# Altium schematic sheet ZhenDong.SchDoc
size A2
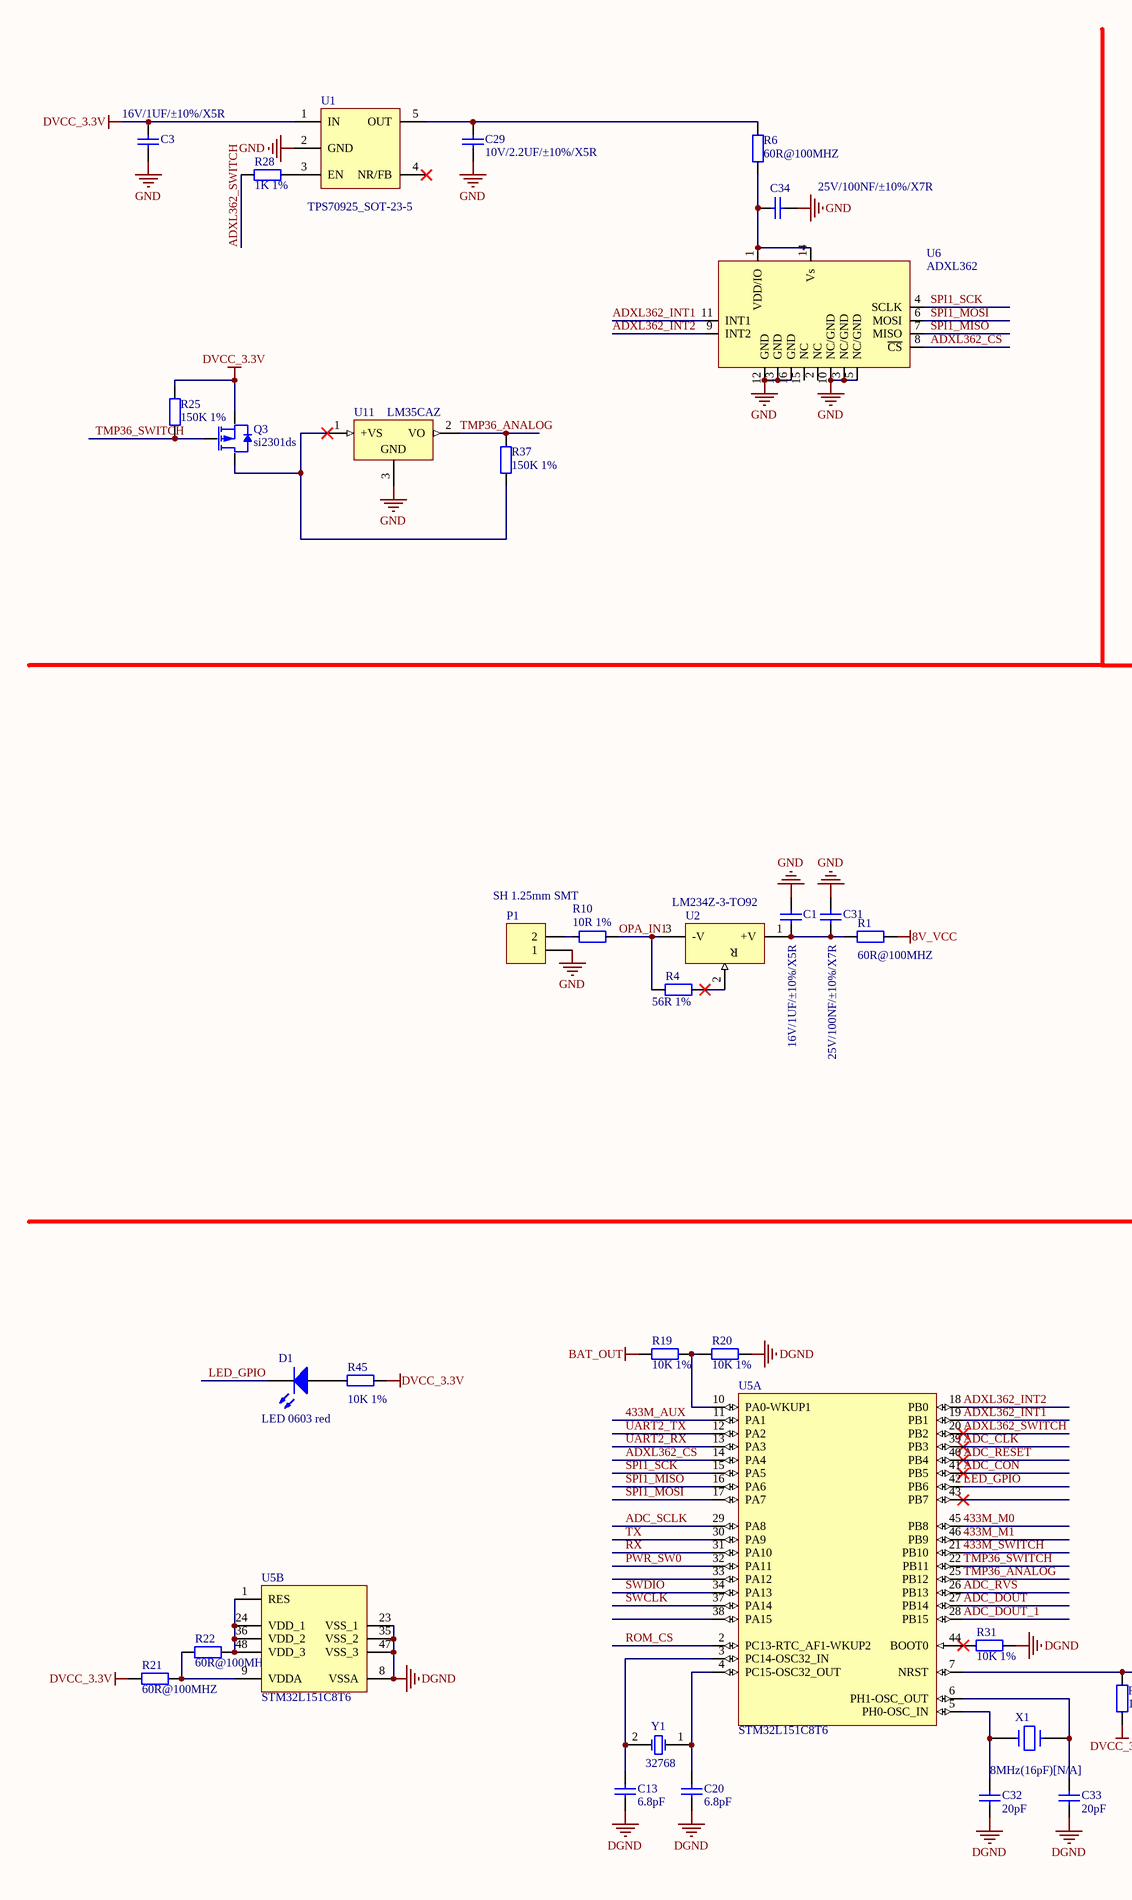
[diagram p0: ZhenDong.SchDoc, left]
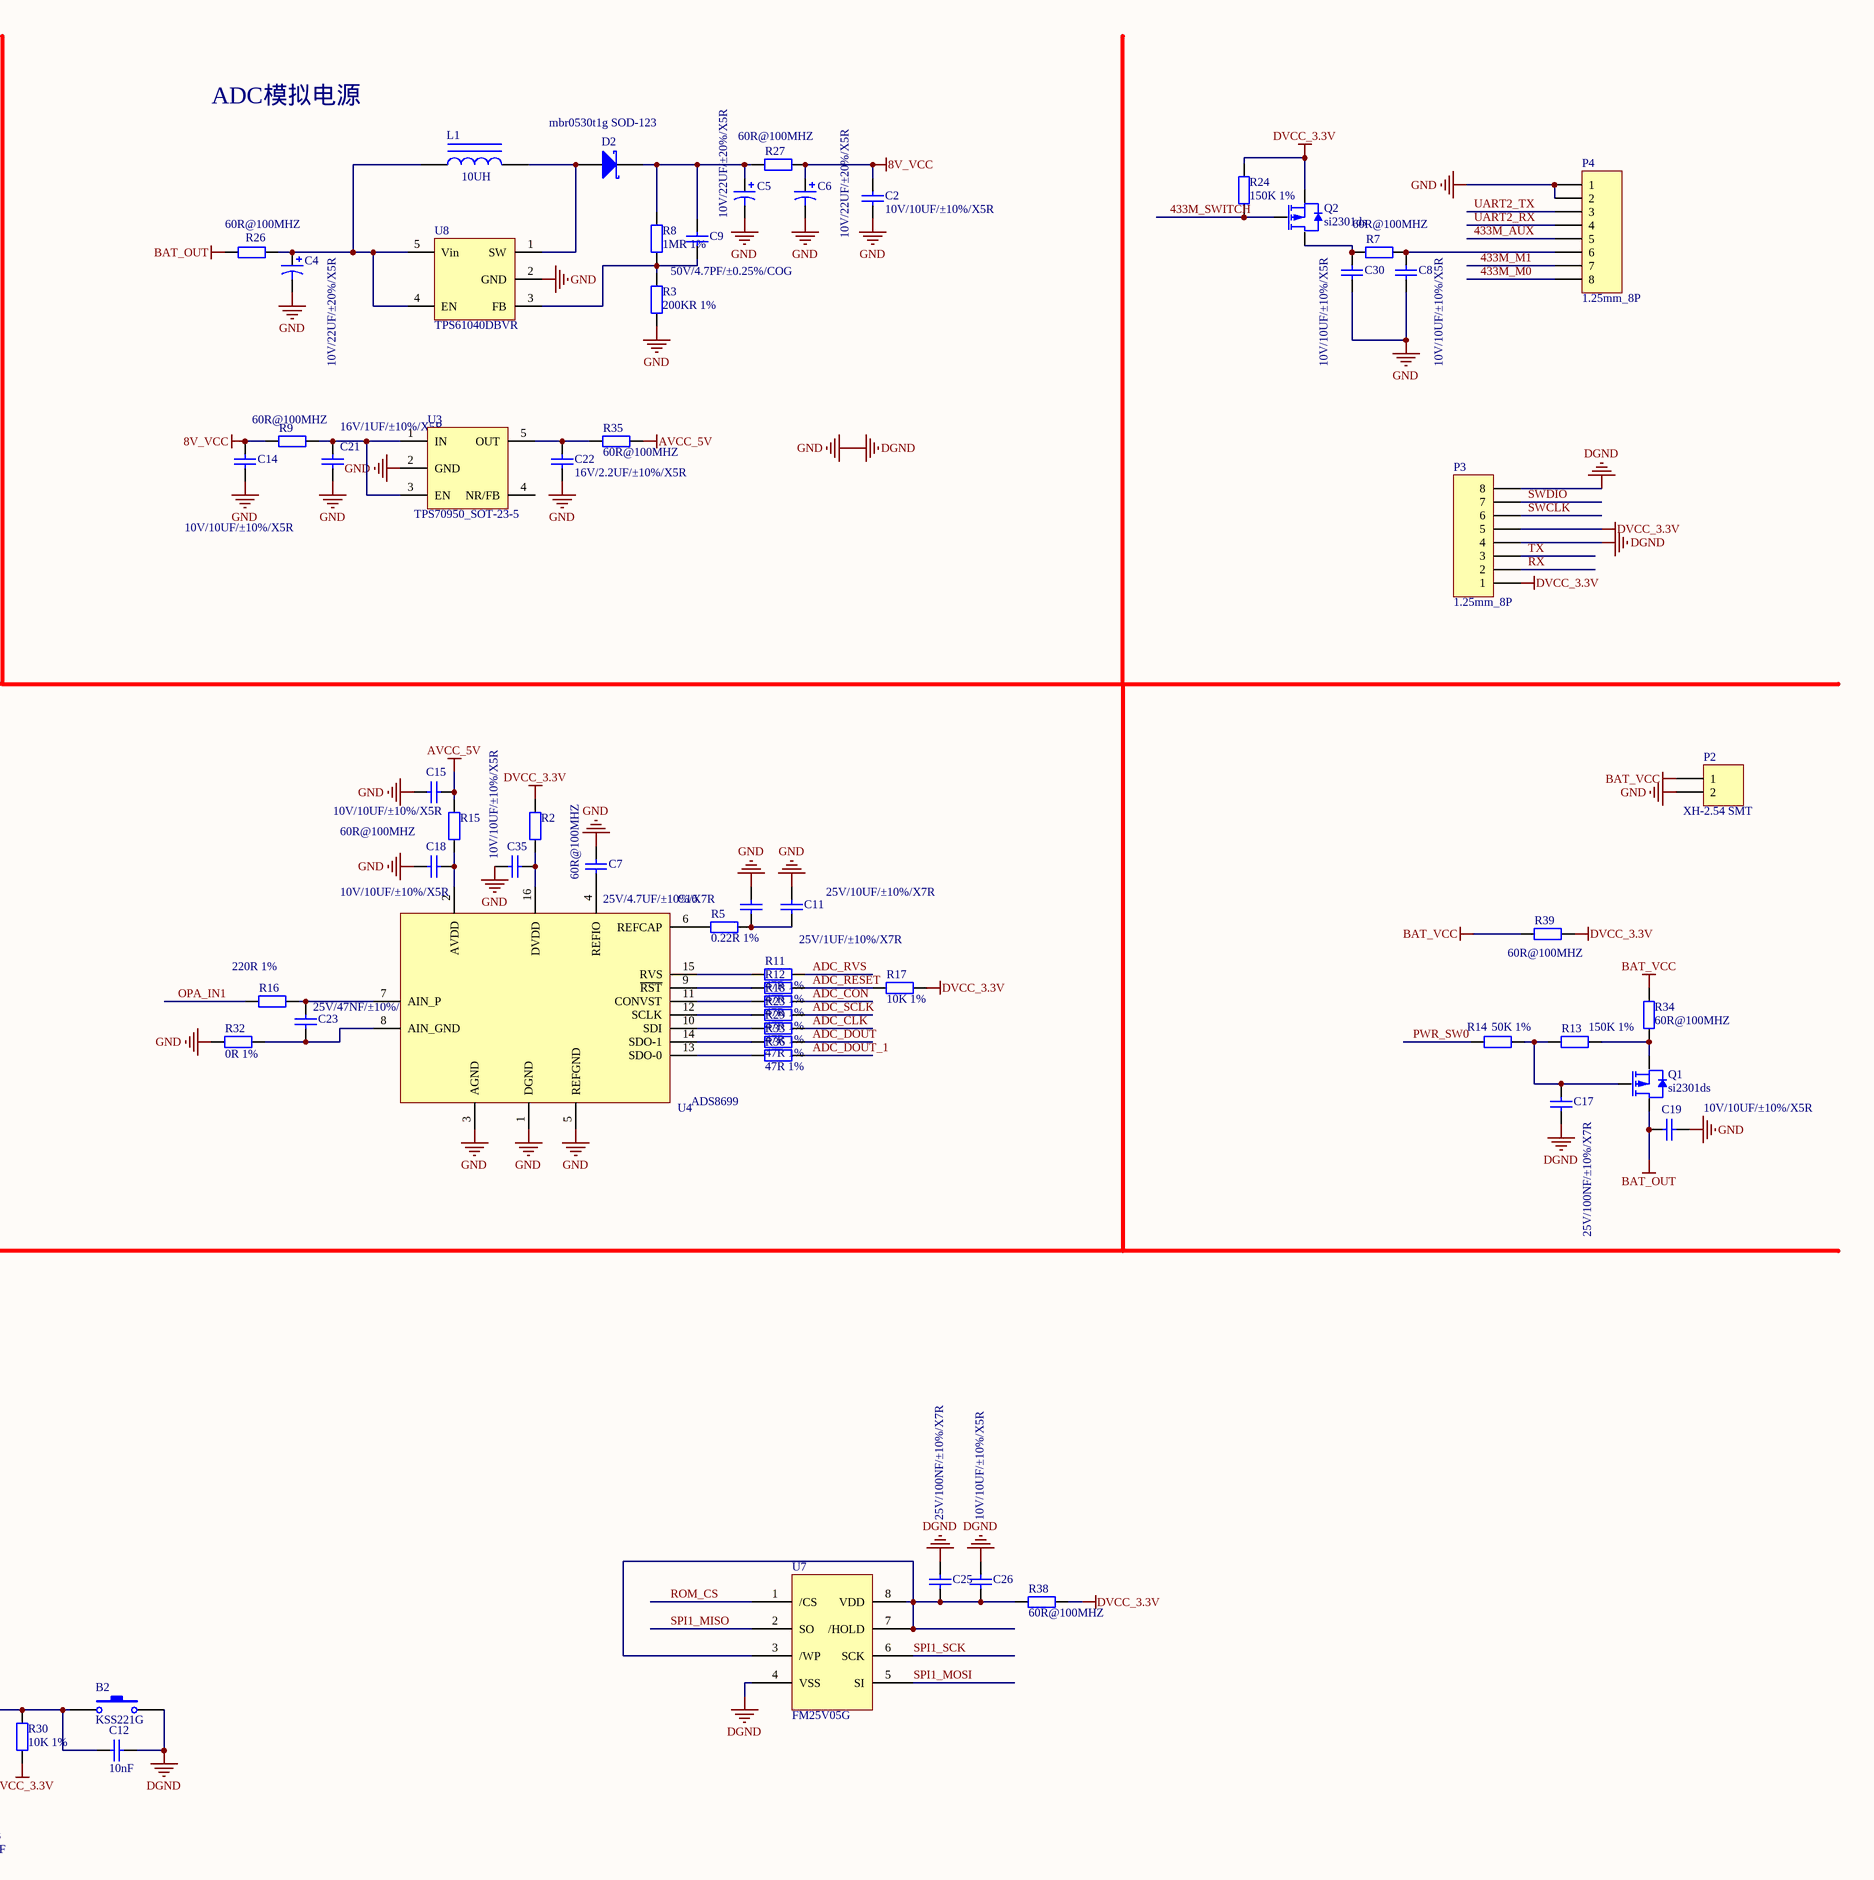
[diagram p1: ZhenDong.SchDoc, right]

## Parts
B2  KSS221G  [MY-KEY1]
C1  value 16V/1UF/±10%/X5R  [0603C]  (hidden comment: Capacitor 0603)
C2  value 10V/10UF/±10%/X5R  [0603C]  (hidden comment: Capacitor 0603)
C3  value 16V/1UF/±10%/X5R  [0603C]  (hidden comment: Capacitor 0603)
C4  value 10V/22UF/±20%/X5R  [0805C]  (hidden comment: Capacitor 0805)
C5  value 10V/22UF/±20%/X5R  [0805C]  (hidden comment: Capacitor 0805)
C6  value 10V/22UF/±20%/X5R  [0805C]  (hidden comment: Capacitor 0805)
C7  value 25V/4.7UF/±10%/X7R  [0603C]  (hidden comment: Capacitor 0603)
C8  value 10V/10UF/±10%/X5R  [0603C]  (hidden comment: Capacitor 0603)
C9  value 50V/4.7PF/±0.25%/COG  [0603C]  (hidden comment: Capacitor 0603)
C11  value 25V/1UF/±10%/X7R  [0603C]  (hidden comment: Capacitor 0603)
C12  10nF  [0603C]
C13  6.8pF  [0603C]
C14  value 10V/10UF/±10%/X5R  [0603C]  (hidden comment: Capacitor 0603)
C15  value 10V/10UF/±10%/X5R  [0603C]  (hidden comment: Capacitor 0603)
C16  value 25V/10UF/±10%/X7R  [0603C]  (hidden comment: Capacitor 0603)
C17  value 25V/100NF/±10%/X7R  [0603C]  (hidden comment: Capacitor 0603)
C18  value 10V/10UF/±10%/X5R  [0603C]  (hidden comment: Capacitor 0603)
C19  value 10V/10UF/±10%/X5R  [0603C]  (hidden comment: Capacitor 0603)
C20  6.8pF  [0603C]
C21  value 16V/1UF/±10%/X5R  [0603C]  (hidden comment: Capacitor 0603)
C22  value 16V/2.2UF/±10%/X5R  [0603C]  (hidden comment: Capacitor 0603)
C23  value 25V/47NF/±10%/X7R  [0603C]  (hidden comment: Capacitor 0603)
C25  value 25V/100NF/±10%/X7R  [0603C]  (hidden comment: Capacitor 0603)
C26  value 10V/10UF/±10%/X5R  [0603C]  (hidden comment: Capacitor 0603)
C29  value 10V/2.2UF/±10%/X5R  [0603C]  (hidden comment: Capacitor 0603)
C30  value 10V/10UF/±10%/X5R  [0603C]  (hidden comment: Capacitor 0603)
C31  value 25V/100NF/±10%/X7R  [0603C]  (hidden comment: Capacitor 0603)
C32  20pF  [0603C]
C33  20pF  [0603C]
C34  value 25V/100NF/±10%/X7R  [0603C]  (hidden comment: Capacitor 0603)
C35  value 10V/10UF/±10%/X5R  [0603C]  (hidden comment: Capacitor 0603)
D1  LED 0603 red  [0603R]
D2  mbr0530t1g SOD-123  [0805D]
L1  value 10UH  [0420]  (hidden comment: Inductance 0420)
P1  SH 1.25mm SMT  [1.25-2p]
P2  XH-2.54 SMT  [2.54_W_2P]
P3  1.25mm_8P  [1.25-8P]
P4  1.25mm_8P  [1.25-8P]
Q1  si2301ds  [SOT-23]
Q2  si2301ds  [SOT-23]
Q3  si2301ds  [SOT-23]
R1  value 60R@100MHZ  [0603R]  (hidden comment: Ferrite Bead 0603)
R2  value 60R@100MHZ  [0603R]  (hidden comment: Ferrite Bead 0603)
R3  value 200KR 1%  [0603R]  (hidden comment: Resistor 0603)
R4  value 56R 1%  [0603R]  (hidden comment: Resistor 0603)
R5  value 0.22R 1%  [0603R]  (hidden comment: Resistor 0603)
R6  value 60R@100MHZ  [0603R]  (hidden comment: Ferrite Bead 0603)
R7  value 60R@100MHZ  [0603R]  (hidden comment: Ferrite Bead 0603)
R8  value 1MR 1%  [0603R]  (hidden comment: Resistor 0603)
R9  value 60R@100MHZ  [0603R]  (hidden comment: Ferrite Bead 0603)
R10  value 10R 1%  [0603R]  (hidden comment: Resistor 0603)
R11  value 47R 1%  [0603R]  (hidden comment: Resistor 0603)
R12  value 47R 1%  [0603R]  (hidden comment: Resistor 0603)
R13  value 150K 1%  [0603R]  (hidden comment: Resistor 0603)
R14  value 50K 1%  [0603R]  (hidden comment: Resistor 0603)
R15  value 60R@100MHZ  [0603R]  (hidden comment: Ferrite Bead 0603)
R16  value 220R 1%  [0603R]  (hidden comment: Resistor 0603)
R17  value 10K 1%  [0603R]  (hidden comment: Resistor 0603)
R18  value 47R 1%  [0603R]  (hidden comment: Resistor 0603)
R19  value 10K 1%  [0603R]  (hidden comment: Resistor 0603)
R20  value 10K 1%  [0603R]  (hidden comment: Resistor 0603)
R21  value 60R@100MHZ  [0603R]  (hidden comment: Ferrite Bead 0603)
R22  value 60R@100MHZ  [0603R]  (hidden comment: Ferrite Bead 0603)
R23  value 47R 1%  [0603R]  (hidden comment: Resistor 0603)
R24  value 150K 1%  [0603R]  (hidden comment: Resistor 0603)
R25  value 150K 1%  [0603R]  (hidden comment: Resistor 0603)
R26  value 60R@100MHZ  [0603R]  (hidden comment: Ferrite Bead 0603)
R27  value 60R@100MHZ  [0603R]  (hidden comment: Ferrite Bead 0603)
R28  value 1K 1%  [0603R]  (hidden comment: Resistor 0603)
R29  value 47R 1%  [0603R]  (hidden comment: Resistor 0603)
R30  value 10K 1%  [0603R]  (hidden comment: Resistor 0603)
R31  value 10K 1%  [0603R]  (hidden comment: Resistor 0603)
R32  value 0R 1%  [0603R]  (hidden comment: Resistor 0603)
R33  value 47R 1%  [0603R]  (hidden comment: Resistor 0603)
R34  value 60R@100MHZ  [0603R]  (hidden comment: Ferrite Bead 0603)
R35  value 60R@100MHZ  [0603R]  (hidden comment: Ferrite Bead 0603)
R36  value 47R 1%  [0603R]  (hidden comment: Resistor 0603)
R37  value 150K 1%  [0603R]  (hidden comment: Resistor 0603)
R38  value 60R@100MHZ  [0603R]  (hidden comment: Ferrite Bead 0603)
R39  value 60R@100MHZ  [0603R]  (hidden comment: Ferrite Bead 0603)
R45  value 10K 1%  [0603R]  (hidden comment: Resistor 0603)
U1  TPS70925_SOT-23-5  [SOT23-5]
U2  LM234Z-3-TO92  [Z03A]
U3  TPS70950_SOT-23-5  [SOT23-5]
U4  ADS8699  [TSSOP16]
U5  STM32L151C8T6  [LQFP48_L]  (parts A,B of 2)
U6  ADXL362  [LGA_CC-16-4]
U7  FM25V05G  [SOP8-long]
U8  TPS61040DBVR  [SOT23-5]
U11  LM35CAZ  [Z03A]
X1  8MHz(16pF)[N/A]  [NLFC3225]
Y1  32768  [CRYSTAL_3215]

## Nets
8V_VCC: C2.2 C6.1 C14.1 R1.2 R9.2 R27.1
AVCC_5V: C15.2 R15.1 R35.1
BAT_OUT: C19.2 Q1.3(D) R19.2 R26.2
BAT_VCC: P2.1 R34.2 R39.1
DGND: B2.2 C1.2 C2.1 C3.2 C4.2 C5.2 C6.2 C7.2 C8.1 C11.2 C12.1 C13.2 C14.2 C15.1 C16.1 C17.2 C18.1 C19.1 C20.2 C21.2 C22.2 C25.1 C26.1 C29.2 C30.2 C31.1 C32.2 C33.2 C34.2 C35.2 P1.1 P2.2 P3.4 P3.8 P4.1 P4.2 R3.2 R20.1 R31.2 R32.1 U1.2(GND) U3.2(GND) U4.1(DGND) U4.3(AGND) U4.5(REFGND) U5.8(VSSA) U5.23(VSS_1) U5.35(VSS_2) U5.47(VSS_3) U6.3(NC/GND) U6.5(NC/GND) U6.10(NC/GND) U6.12(GND) U6.13(GND) U6.16(GND) U7.4(VSS) U8.2(GND) U11.3(GND)  [also labelled GND]
DVCC_3.3V: C3.1 P3.1 P3.5 Q2.2(S) Q3.2(S) R2.1 R17.1 R21.2 R24.2 R25.2 R30.2 R38.2 R39.2 R45.1 U1.1(IN)
433M_AUX: P4.5 U5.11(PA1)
433M_M0: P4.8 U5.45(PB8)
433M_M1: P4.7 U5.46(PB9)
433M_SWITCH: Q2.1(G) R24.1 U5.21(PB10)
ADC_CLK: R29.1 U5.39(PB3)
ADC_CON: R18.1 U5.41(PB5)
ADC_DOUT: R33.1 U5.27(PB14)
ADC_DOUT_1: R36.1 U5.28(PB15)
ADC_RESET: R12.1 R17.2 U5.40(PB4)
ADC_RVS: R11.1 U5.26(PB13)
ADC_SCLK: R23.1 U5.29(PA8)
ADXL362_~{CS}: U5.14(PA4) U6.8(~{CS})
ADXL362_INT1: U5.19(PB1) U6.11(INT1)
ADXL362_INT2: U5.18(PB0) U6.9(INT2)
ADXL362_SWITCH: R28.2 U5.20(PB2)
LED_GPIO: D1.2(K) U5.42(PB6)
OPA_IN1: R4.1 R10.1 R16.1 U2.3(-V)
PWR_SW0: R14.2 U5.32(PA11)
ROM_CS: U5.2(PC13-RTC_AF1-WKUP2) U7.1(/CS)
RX: P3.2 U5.31(PA10)
SPI1_MISO: U5.16(PA6) U6.7(MISO) U7.2(SO)
SPI1_MOSI: U5.17(PA7) U6.6(MOSI) U7.5(SI)
SPI1_SCK: U5.15(PA5) U6.4(SCLK) U7.6(SCK)
SWCLK: P3.6 U5.37(PA14)
SWDIO: P3.7 U5.34(PA13)
TMP36_ANALOG: R37.2 U5.25(PB12) U11.2(VO)
TMP36_SWITCH: Q3.1(G) R25.1 U5.22(PB11)
TX: P3.3 U5.30(PA9)
UART2_RX: P4.4 U5.13(PA3)
UART2_TX: P4.3 U5.12(PA2)
NetB2_1: B2.1 C12.2 R30.1 U5.7(NRST)
NetC1_1: C1.1 C31.2 R1.1 U2.1(+V)
NetC4_1: C4.1 L1.1 R26.1 U8.4(EN) U8.5(Vin)
NetC5_1: C5.1 C9.1 D2.K R8.1 R27.2
NetC7_1: C7.1 U4.4(REFIO)
NetC8_2: C8.2 P4.6 R7.2
NetC9_2: C9.2 R3.1 R8.2 U8.3(FB)
NetC11_1: C11.1 C16.2 R5.1
NetC13_1: C13.1 U5.3(PC14-OSC32_IN) Y1.2(OSC2)
NetC17_1: C17.1 Q1.1(G) R13.2 R14.1
NetC18_2: C18.2 R15.2 U4.2(AVDD)
NetC20_1: C20.1 U5.4(PC15-OSC32_OUT) Y1.1(OSC1)
NetC21_1: C21.1 R9.1 U3.1(IN) U3.3(EN)
NetC22_1: C22.1 R35.2 U3.5(OUT)
NetC23_1: C23.1 R16.2 U4.7(AIN_P)
NetC23_2: C23.2 R32.2 U4.8(AIN_GND)
NetC25_2: C25.2 C26.2 R38.1 U7.3(/WP) U7.7(/HOLD) U7.8(VDD)
NetC29_1: C29.1 R6.1 U1.5(OUT)
NetC30_1: C30.1 Q2.3(D) R7.1
NetC32_1: C32.1 U5.5(PH0-OSC_IN) X1.1
NetC33_1: C33.1 U5.6(PH1-OSC_OUT) X1.2
NetC34_1: C34.1 R6.2 U6.1(VDD/IO) U6.14(Vs)
NetC35_1: C35.1 R2.2 U4.16(DVDD)
NetD1_1: D1.1(A) R45.2
NetD2_A: D2.A L1.2 U8.1(SW)
NetP1_2: P1.2 R10.2
NetQ1_2: Q1.2(S) R13.1 R34.1
NetQ3_3: Q3.3(D) R37.1 U11.1(+VS)
NetR4_2: R4.2 U2.2(R)
NetR5_2: R5.2 U4.6(REFCAP)
NetR11_2: R11.2 U4.15(RVS)
NetR12_2: R12.2 U4.9(~{RST})
NetR18_2: R18.2 U4.11(CONVST)
NetR19_1: R19.1 R20.2 U5.10(PA0-WKUP1)
NetR21_1: R21.1 R22.2 U5.9(VDDA)
NetR22_1: R22.1 U5.1(RES) U5.24(VDD_1) U5.36(VDD_2) U5.48(VDD_3)
NetR23_2: R23.2 U4.12(SCLK)
NetR28_1: R28.1 U1.3(EN)
NetR29_2: R29.2 U4.10(SDI)
NetR31_1: R31.1 U5.44(BOOT0)
NetR33_2: R33.2 U4.14(SDO-1)
NetR36_2: R36.2 U4.13(SDO-0)

Not connected (* = marked no-connect by the designer): U1 4(NR/FB)*; U3 4(NR/FB); U5 33(PA12) 38(PA15) 43(PB7)*; U6 2(NC) 15(NC)

## Notes on the sheet
- ADC模拟电源

## Library data of the parts
B2 = SW-PB: Switch; Published: 24-Mar-1999; LatestRevisionDate: 17-Jul-2002; LatestRevisionNote: Re-released for DXP Platform.; PackageReference: SPST-2; Publisher: Altium Limited
C1-C3 C7-C9 C11 C14-C19 C21-C23 C25 C26 C29-C31 C34 C35 = Cap: Capacitor; Published: 8-Jun-2000; LatestRevisionDate: 17-Jul-2002; LatestRevisionNote: Re-released for DXP Platform.; PackageReference: RAD-0.3; Publisher: Altium Limited; PackageDescription: Radial Cap, Thru-Hole; 2 Leads; 0.3 in Pin Spacing
C4-C6 = Cap Pol3: Polarized Capacitor (Surface Mount); Published: 8-Jun-2000; LatestRevisionDate: 29-May-2009; LatestRevisionNote: IPC-7351 Footprint Added.; PackageReference: C0805; Publisher: Altium Limited; PackageDescription: Chip Capacitor
C12 C13 C20 C32 C33 = CAP: Capacitor; Value: 100pF; Published: 8-Jun-2000; Revision: July-2002: Re-released for DXP Platform.; Publisher: Altium Limited
D1 = LED0: LED 0603 红色; Published: 8-Jun-2000; LatestRevisionDate: 08-Jul-2005; LatestRevisionNote: Mech Layer 1 removed.; PackageReference: LED-0; Publisher: Altium Limited; PackageDescription: LED; 2 Leads
D2 = D Schottky: Schottky Diode SOD−123; Published: 8-Jun-2000; LatestRevisionDate: 17-Jul-2002; LatestRevisionNote: Re-released for DXP Platform.; PackageReference: SMB; Publisher: Altium Limited; PackageDescription: DO-214-AA/SMB; 2 C-Bend Leads; Body 5.3 x 3.6 mm, inc. leads (LxW); Code_JEDEC: DO-214-AA
L1 = Inductor Iron: Magnetic-Core Inductor; Published: 24-Mar-1999; LatestRevisionDate: 17-Jul-2002; LatestRevisionNote: Re-released for DXP Platform.; PackageReference: AXIAL-0.9; Publisher: Altium Limited; PackageDescription: Axial Device, Thru-Hole; 2 Leads; 0.9 in Pin Spacing
P1 = Header 2H: Header, 2-Pin,1.25mm SMT; LatestRevisionDate: 17-Jul-2002; LatestRevisionNote: Re-released for DXP Platform.; Publisher: Altium Limited
P2 = Header 2H: Header, 2-Pin, Right Angle; LatestRevisionDate: 17-Jul-2002; LatestRevisionNote: Re-released for DXP Platform.; Publisher: Altium Limited
P3 P4 = Header 8: Header, 8-Pin; LatestRevisionDate: 17-Jul-2002; LatestRevisionNote: Re-released for DXP Platform.; Publisher: Altium Limited
Q1-Q3 = PMOS: SOT23
R1 R2 R6 R7 R9 R15 R21 R22 R26 R27 R34 R35 R38 R39 = Res2: Ferrite Bead  0603 60R@100MHZ; Published: 8-Jun-2000; LatestRevisionDate: 17-Jul-2002; LatestRevisionNote: Re-released for DXP Platform.; PackageReference: AXIAL-0.4; Publisher: Altium Limited; PackageDescription: Axial Device, Thru-Hole; 2 Leads; 0.4 in Pin Spacing
R3-R5 R8 R10-R14 R16-R20 R23-R25 R28-R33 R36 R37 R45 = Res2: Resistor; Published: 8-Jun-2000; LatestRevisionDate: 17-Jul-2002; LatestRevisionNote: Re-released for DXP Platform.; PackageReference: AXIAL-0.4; Publisher: Altium Limited; PackageDescription: Axial Device, Thru-Hole; 2 Leads; 0.4 in Pin Spacing
U1 U3 = TPS70950: SOT23-5
U2 = LM234Z-3: 3-Terminal Adjustable Current Source, 3-pin TO-92; Manufacturer: National Semiconductor; PackageTopMarking: NSXYTT*LM234*Z-3; PowerWise: N; CompType: MiscPower; Published: 4-Dec-2008; DatasheetVersion: Mar-2005; PackageVersion: revG, Sep-2000; PackageReference: Z03A; Publisher: Altium Limited; PackageDescription: TO-92, Molded, 3 Lead; PartNumber: LM234Z-3; RoHS: N; PinCount: 3; Code_JEDEC: TO-226-AA; ComponentLink1Description: LM234 Datasheet; ComponentLink1URL: http://www.national.com/ds/LM/LM234.pdf; ComponentLink2Description: LM234 Web Page; ComponentLink2URL: http://www.national.com/pf/LM/LM234.html; ComponentLink3Description: Z03A Package Page; ComponentLink3URL: http://www.national.com/packaging/folders/z03a.html
U5 = STM32L151C8T6: STM32L ARM-based EnergyLite 32-bit MCU, 64 kB Flash, 10 kB Internal RAM, -40 to +85癈 Temperature, 48-pin LQFP, Tray; DatasheetVersion: rev6, Jan-2012; PackageVersion: rev13, Apr-2011; PackageReference: LQFP48; PackageDescription: 48-Pin Low-Profile Quad Flat Pack, 7 x 7 mm Body, 0.5 mm Pitch (LQFP48); ComponentLink1Description: Manufacturer URL; ComponentLink1URL: http://www.st.com/; ComponentLink2Description: STM32L151/152 Datasheet; ComponentLink2URL: http://www.st.com/internet/com/TECHNICAL_RESOURCES/TECHNICAL_LITERATURE/DATASHEET/CD00277537.pdf; ComponentLink3Description: STM32 L1 Family Web Page; ComponentLink3URL: http://www.st.com/internet/mcu/subclass/1376.jsp
U6 = ADXL362: ADXL362BCCZ LGA16
U7 = fm25cl64: FM25V05G SOP8
U8 = TPS61040: SOT23-5
U11 = LM35CAZ: Precision Centigrade Temperature Sensor, 3-pin TO-92; Manufacturer: National Semiconductor; PackageTopMarking: NSXYTT*LM35*CAZ; PowerWise: N; CompType: Temp Sensor IC; Published: 4-Dec-2008; LatestRevisionDate: 15-Jul-2009; LatestRevisionNote: Sch pins 1 & 3 reversed.; DatasheetVersion: Nov-2000; PackageVersion: revG, Sep-2000; PackageReference: Z03A; Publisher: Altium Limited; PackageDescription: TO-92, Molded, 3 Lead; Supplier 1: Farnell; Supplier Part Number 1: 9494529; PartNumber: LM35CAZ; RoHS: N; PinCount: 3; Code_JEDEC: TO-226-AA; ComponentLink1Description: LM35 Datasheet; ComponentLink1URL: http://www.national.com/ds/LM/LM35.pdf; ComponentLink2Description: LM35 Web Page; ComponentLink2URL: http://www.national.com/pf/LM/LM35.html; ComponentLink3Description: Z03A Package Page; ComponentLink3URL: http://www.national.com/packaging/folders/z03a.html
X1 = CRYSTAL: 3225 2P 8MHZ
Y1 = XTAL: Crystal Oscillator  3215无源; Published: 8-Jun-2000; LatestRevisionDate: 17-Jul-2002; LatestRevisionNote: Re-released for DXP Platform.; PackageReference: R38; Publisher: Altium Limited; PackageDescription: Crystal, Thru-Hole; 2 Leads; Body 3.1 x 8.2 mm (Dia.xH)